# Altium schematic sheet PaisleyDetector.SchDoc
size A3
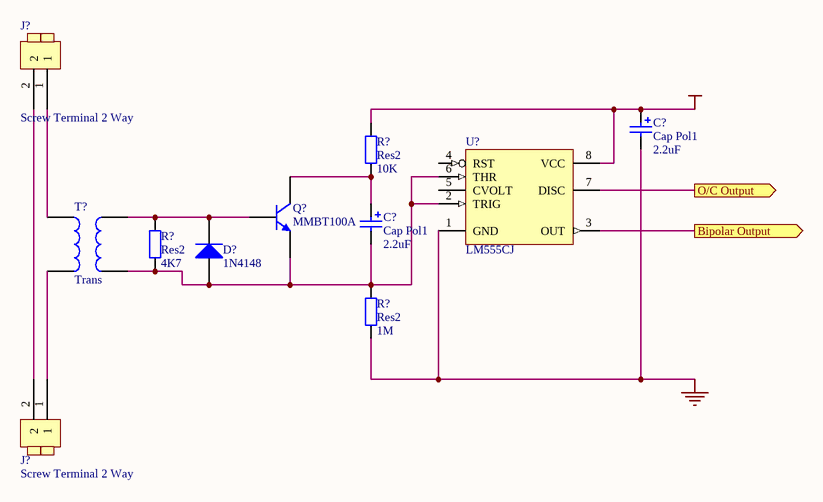
[diagram p0: PaisleyDetector.SchDoc]

## Parts
(Parts that share a designator on the sheet are numbered #1, #2 ... from top to bottom, then left to right.)
C?#1  Cap Pol1  value 2.2uF  [RB7.6-15]
C?#2  Cap Pol1  value 2.2uF  [RB7.6-15]
D?  1N4148  [DIO7.1-3.9x1.9]
J?#1  Screw Terminal 2 Way  [Screw Terminal 2 way 0.2]
J?#2  Screw Terminal 2 Way  [Screw Terminal 2 way 0.2]
Q?  MMBT100A  [SO-G3]
R?#1  Res2  value 10K  [CR2012-0805]
R?#2  Res2  value 4K7  [CR2012-0805]
R?#3  Res2  value 1M  [CR2012-0805]
T?  Trans  [TRANS]
U?  LM555CJ  [J08A]

## Ports
Bipolar Output (out), O/C Output (out)

## Nets
GND: C?#1.2 R?#3.1 U?.1(GND)
VCC: C?#1.1 R?#1.2 U?.8(VCC)
Bipolar Output: U?.3(OUT) ; port Bipolar Output
O/C Output: U?.7(DISC) ; port O/C Output
NetC?#2_1: C?#2.1 Q?.3(C) R?#1.1
NetC?#2_2: C?#2.2 D?.1(A) Q?.2(E) R?#2.1 R?#3.2 T?.4 U?.2(TRIG) U?.6(THR)
NetD?_2: D?.2(K) Q?.1(B) R?#2.2 T?.3
NetJ?#1_1: J?#1.1 T?.1
NetJ?#1_2: J?#1.2 J?#2.2
NetJ?#2_1: J?#2.1 T?.2

Not connected (* = marked no-connect by the designer): U? 4(RST) 5(CVOLT)

## Library data of the parts
C?#1 C?#2 = Cap Pol1: Polarized Capacitor (Radial); Published: 8-Jun-2000; Revision: July-2002: Re-released for DXP Platform.; Publisher: Altium Limited
D? = Diode 1N4148: High Conductance Fast Diode; Revision 1: 11-Jul-2000: SIM Model Added.; Revision 2: 17-Jul-2002: Re-released for DXP Platform.; Code - JEDEC: DO-204-AH; Published: 8-Jun-2000; Datasheet: Latest Revision: 1997; Package Reference: DO-35; Publisher: Altium Limited
Q? = MMBT100A: General Purpose Amplifier NPN Silicon; Package Information: Latest Revision: 1997; Published: 29-Sep-2000; Revision: 17-Jul-2002: Re-released for DXP Platform.; Datasheet: Latest Revision: 1996; Package Reference: 318-08; Publisher: Altium Limited
R?#1-R?#3 = Res2: Resistor; Published: 8-Jun-2000; Revision: July-2002: Re-released for DXP Platform.; Publisher: Altium Limited
T? = Trans: Transformer; Published: 24-Mar-1999; Revision: July-2002: Re-released for DXP Platform.; Publisher: Altium Limited
U? = LM555CJ: Timer; Package Information: Latest Revision: 2000; Published: 15-Apr-2002; Datasheet: Latest Revision: May-1997; Package Reference: J08A; Publisher: Altium Limited